# Altium project WRO.PrjPcb
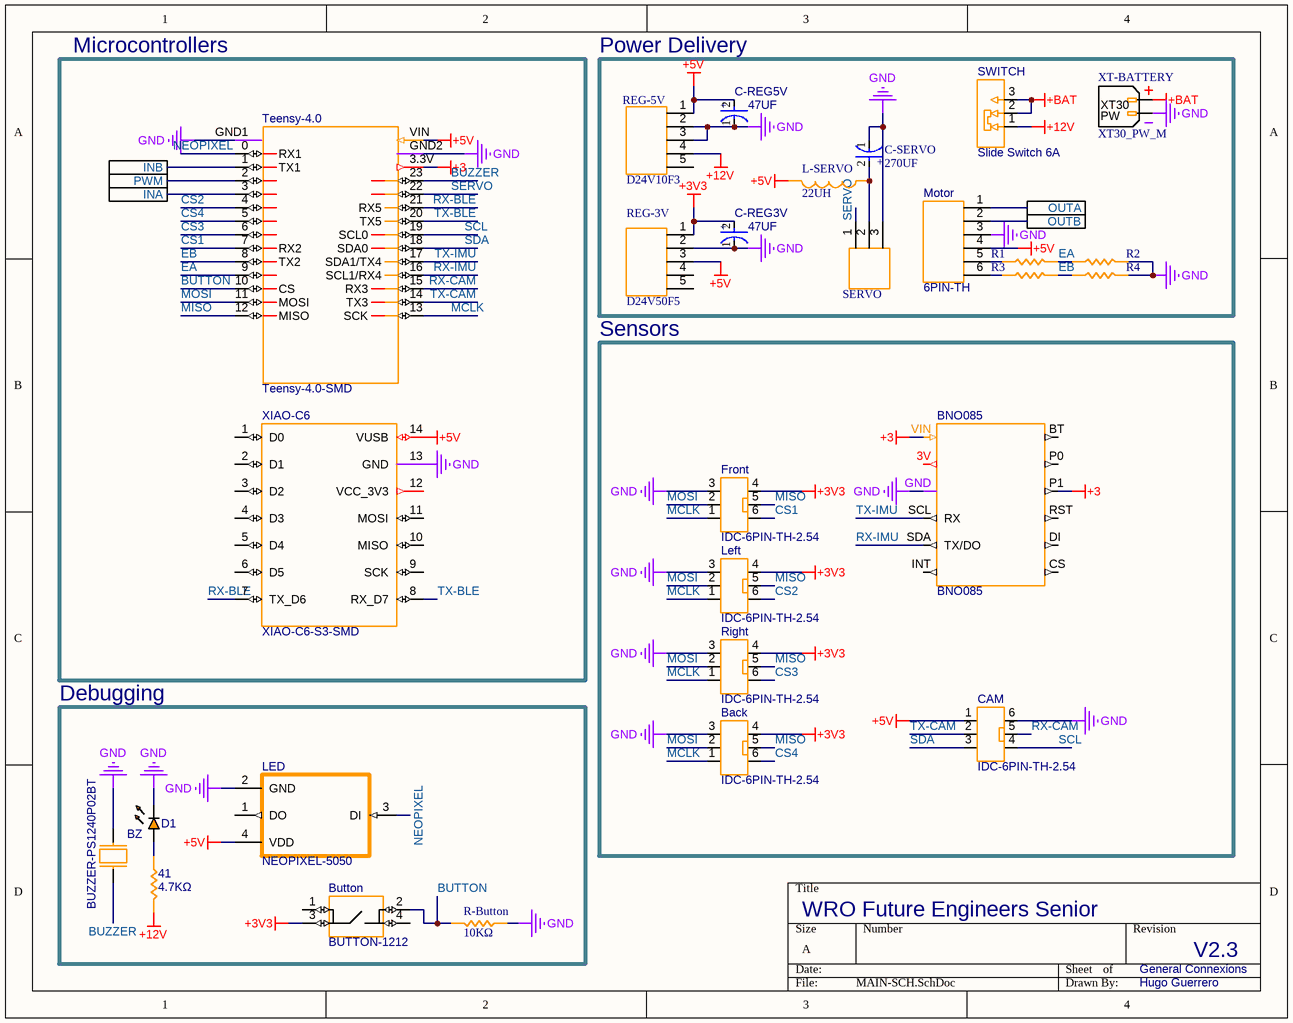
[diagram p0: MAIN-SCH.SchDoc]
2 sheets, 44 parts. Net scope: flat (ports and power ports of the same name join across sheets).
Board file: MAIN-PCB.PcbDoc
Sheets:
  MAIN-SCH.SchDoc
  H-BRIDGE-SCH.SchDoc

## Sheet MAIN-SCH.SchDoc
size A; SheetNumber: 1; SheetTotal: 2

### Parts
41  4.7KΩ  [RES_0603]
Back  IDC-6PIN-TH-2.54  [IDC-6PIN-TH-2.54]
BNO085  BNO085  [BNO085]
Button  BUTTON-1212  [BUTTON]
BZ  BUZZER-PS1240P02BT  [BUZZER]
C-REG3V  47UF  [FP-FTD8-MFG]
C-REG5V  47UF  [FP-FTD8-MFG]
C-SERVO  270UF  [FP-FTD8-MFG]
CAM  IDC-6PIN-TH-2.54  [IDC-6PIN-TH-2.54]
D1  LED_0603  [LED_0603]  (value not drawn)
D24V10F3  REG-5V  [5PIN-TH]
D24V50F5  REG-3V  [5PIN-TH]
Front  IDC-6PIN-TH-2.54  [IDC-6PIN-TH-2.54]
L-SERVO  22UH  [WRO-INDUCTOR]
LED  NEOPIXEL-5050  [NEOPIXEL-5050]
Left  IDC-6PIN-TH-2.54  [IDC-6PIN-TH-2.54]
Motor  6PIN-TH  [6PIN-TH]
R1  10KΩ  [RES_0603]  (value not drawn)
R2  10KΩ  [RES_0603]  (value not drawn)
R3  10KΩ  [RES_0603]  (value not drawn)
R4  10KΩ  [RES_0603]  (value not drawn)
R-Button  10KΩ  [RES_0603]
Right  IDC-6PIN-TH-2.54  [IDC-6PIN-TH-2.54]
SERVO  3PIN  [3PIN]  (value not drawn)
SWITCH  Slide Switch 6A  [Slide Switch 6A]
Teensy-4.0  Teensy-4.0-SMD  [Teensy-4.0-SMD]
XIAO-C6  XIAO-C6-S3-SMD  [XIAO-C6-S3-SMD]
XT-BATTERY  XT30_PW_M  [XT30_PW_M]

### Blocks framed on the sheet
Microcontrollers: Teensy-4.0 XIAO-C6
Power Delivery: C-REG3V C-REG5V C-SERVO D24V10F3 D24V50F5 L-SERVO Motor R1-R4 SERVO SWITCH XT-BATTERY
Sensors: Back BNO085 CAM Front Left Right
Debugging: 41 Button BZ D1 LED R-Button

### Ports
INA (see VNH7070-P[1C]), INB (see VNH7070-P[1C]), OUTA (see VNH7070-P[3C]), OUTB (see VNH7070-P[3C]), PWM (see VNH7070-P[1C])

### Nets
+3: BNO085.P1 BNO085.VIN Teensy-4.0.3.3V(3.3V-2)
+3V3: Back.4 Button.3 C-REG3V.2(A) D24V50F5.1 Front.4 Left.4 Right.4
+5V: C-REG5V.2(A) CAM.1 D24V10F3.1 D24V50F5.3 L-SERVO.2 LED.4(VDD) Motor.4 Teensy-4.0.VIN XIAO-C6.14(VUSB)
+12V: 41.1 D24V10F3.4 SWITCH.1(NC)
+BAT: SWITCH.2(COM) SWITCH.3(NO) XT-BATTERY.P
GND: Back.3 BNO085.GND BZ.2 C-REG3V.1(C) C-REG5V.1(C) C-SERVO.1(C) CAM.6 D1.C D24V10F3.2 D24V10F3.3 D24V50F5.2 Front.3 LED.2(GND) Left.3 Motor.3 R2.1 R4.1 R-Button.2 Right.3 SERVO.3 Teensy-4.0.GND1 Teensy-4.0.GND2(GND3) XIAO-C6.13(GND) XT-BATTERY.N
BUTTON: Button.2 R-Button.1 Teensy-4.0.10(CS)
BUZZER: BZ.1 Teensy-4.0.23
CS1: Front.6 Teensy-4.0.7(RX2)
CS2: Left.6 Teensy-4.0.4
CS3: Right.6 Teensy-4.0.6
CS4: Back.6 Teensy-4.0.5
EA: R1.1 R2.2 Teensy-4.0.9
EB: R3.1 R4.2 Teensy-4.0.8(TX2)
MCLK: Back.1 Front.1 Left.1 Right.1 Teensy-4.0.13(SCK)
MISO: Back.5 Front.5 Left.5 Right.5 Teensy-4.0.12(MISO)
MOSI: Back.2 Front.2 Left.2 Right.2 Teensy-4.0.11(MOSI)
NEOPIXEL: LED.3(DI) Teensy-4.0.0(RX1)
OUTA: Motor.1 ; port OUTA
OUTB: Motor.2 ; port OUTB
RX-BLE: Teensy-4.0.21(RX5) XIAO-C6.7(TX_D6)
RX-CAM: CAM.5 Teensy-4.0.15(RX3)
RX-IMU: BNO085.SDA(TX/DO) Teensy-4.0.16(SCL1/RX4)
SCL: CAM.4 Teensy-4.0.19(SCL0)
SDA: CAM.3 Teensy-4.0.18(SDA0)
SERVO: SERVO.1 Teensy-4.0.22
TX-BLE: Teensy-4.0.20(TX5) XIAO-C6.8(RX_D7)
TX-CAM: CAM.2 Teensy-4.0.14(TX3)
TX-IMU: BNO085.SCL(RX) Teensy-4.0.17(SDA1/TX4)
Net41_2: 41.2 D1.A
NetC-SERVO_2: C-SERVO.2(A) L-SERVO.1 SERVO.2
NetMotor_5: Motor.5 R1.2
NetMotor_6: Motor.6 R3.2
NetR41_1: Teensy-4.0.3 ; port INA
NetR42_1: Teensy-4.0.1(TX1) ; port INB
NetR43_1: Teensy-4.0.2 ; port PWM

Not connected (* = marked no-connect by the designer): BNO085 3V BT CS DI INT P0 RST; Button 1 4; D24V10F3 5(05); D24V50F5 4(04) 5(05); LED 1(DO); XIAO-C6 1(D0) 2(D1) 3(D2) 4(D3) 5(D4) 6(D5) 9(SCK) 10(MISO) 11(MOSI) 12(VCC_3V3)

### Notes on the sheet
- WRO Future Engineers Senior
- General Connexions
- V2.3
- Hugo Guerrero
- (in symbol CMP-05427-000088-1) +
- (in symbol XT30_PW_M) XT30; PW

### Library data of the parts
41 R1-R4 R-Button = RES_0603: Resistor SMD 0603 generic
Button = BUTTON
C-REG3V C-REG5V C-SERVO = CMP-05427-000088-1: CAP ALUM 220UF 20% 25V SMD; Dielectric Material: Aluminium; ESR (Equivalent Series Resistance): 160mR; Ripple Current: 600mA; Life (Hours): 2000Hour; Leakage Current: 55uA; Lead Diameter: 0.65mm; Series: FT; RoHS Compliant: Yes; Case/Package: Radial; Packaging: Tape and Reel; Contact Plating: Tin; Package Quantity: 1; Mount: Surface Mount; Number of Pins: 8; Tolerance: 20%; Height - Seated (Max): 0.315inch; Length: 7.7mm; Lead Free: Lead Free; Voltage: 25V; Construction: Cylindrical; Radiation Hardening: No; Lead Pitch: 1.8mm; REACH SVHC: No SVHC; Capacitance: 220uF; Voltage Rating: 25V; Height: 7.7mm; Diameter: 6.3mm; Max Operating Temperature: 105°C; Termination: SMD/SMT; Min Operating Temperature: -55°C; Voltage Rating (DC): 25V; Ripple Current (AC): 600mA
D24V10F3 D24V50F5 = 5PIN-TH: 2.54 Header
L-SERVO = WRO-INDUCTOR: Voltage Boost Inductor
SERVO = 3PIN: 2.54 Header

## Sheet H-BRIDGE-SCH.SchDoc
size A; SheetNumber: 2; SheetTotal: 2
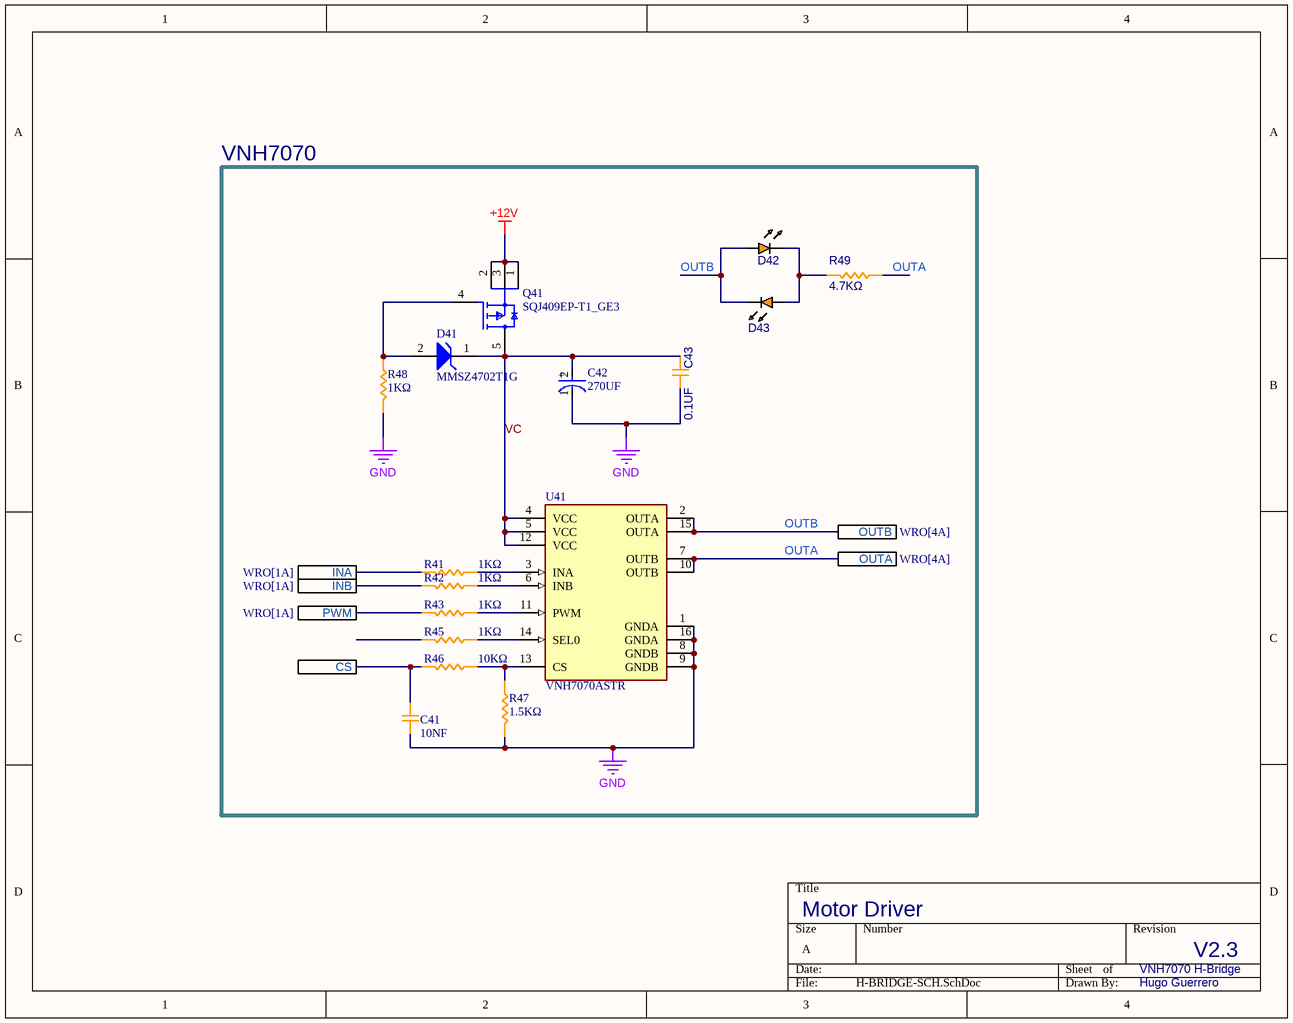
[diagram p1: H-BRIDGE-SCH.SchDoc]

### Parts
C41  10NF  [CAP_0603]
C42  270UF  [FP-FTD8-MFG]
C43  0.1UF  [CAP_0603]
D41  MMSZ4702T1G  [ONSC-SOD-123-2-425-04_V]
D42  LED_0603  [LED_0603]  (value not drawn)
D43  LED_0603  [LED_0603]  (value not drawn)
Q41  SQJ409EP-T1_GE3  [FP-T16-0221-SINGLE-MFG]
R41  1KΩ  [RES_0603]
R42  1KΩ  [RES_0603]
R43  1KΩ  [RES_0603]
R45  1KΩ  [RES_0603]
R46  10KΩ  [RES_0603]
R47  1.5KΩ  [RES_0603]
R48  1KΩ  [RES_0603]
R49  4.7KΩ  [RES_0603]
U41  VNH7070ASTR  [FP-SO-16N-GAPGCFT00818-MFG]

### Blocks framed on the sheet
VNH7070: C41-C43 D41-D43 Q41 R41-R43 R45-R49 U41

### Ports
CS, INA (see WRO[1A]), INB (see WRO[1A]), OUTA (see WRO[4A]), OUTB (see WRO[4A]), PWM (see WRO[1A])

### Nets
+12V: Q41.1(S) Q41.2(S) Q41.3(S)
GND: C41.1 C42.1(C) C43.2 R47.1 R48.1 U41.1(GNDA) U41.8(GNDB) U41.9(GNDB) U41.16(GNDA)
OUTA: R49.2 U41.7(OUTB) U41.10(OUTB) ; port OUTA
OUTB: D42.A D43.C U41.2(OUTA) U41.15(OUTA) ; port OUTB
VC: C42.2(A) C43.1 D41.1(K) Q41.5(D) U41.4(VCC) U41.5(VCC) U41.12(VCC)
NetC41_2: C41.2 R46.1 ; port CS
NetD41_2: D41.2(A) Q41.4(G) R48.2
NetD42_C: D42.C D43.A R49.1
NetR41_1: R41.1 ; port INA
NetR41_2: R41.2 U41.3(INA)
NetR42_1: R42.1 ; port INB
NetR42_2: R42.2 U41.6(INB)
NetR43_1: R43.1 ; port PWM
NetR43_2: R43.2 U41.11(PWM)
NetR45_2: R45.2 U41.14(SEL0)
NetR46_2: R46.2 R47.2 U41.13(CS)

Not connected (* = marked no-connect by the designer): R45 1

### Notes on the sheet
- Motor Driver
- VNH7070 H-Bridge
- V2.3
- Hugo Guerrero
- (in symbol CMP-05427-000088-1) +

### Library data of the parts
C41 C43 = CAP_0603: Capacitor SMD 0603 generic
C42 = CMP-05427-000088-1: as C-REG3V on sheet MAIN-SCH; Series: FT; RoHS Compliant: Yes; Case/Package: Radial; Packaging: Tape and Reel; Contact Plating: Tin; Package Quantity: 1; Mount: Surface Mount; Number of Pins: 8; Tolerance: 20%; Height - Seated (Max): 0.315inch; Length: 7.7mm; Lead Free: Lead Free; Voltage: 25V; Construction: Cylindrical; Radiation Hardening: No; Lead Pitch: 1.8mm; REACH SVHC: No SVHC; Capacitance: 220uF; Voltage Rating: 25V; Height: 7.7mm; Diameter: 6.3mm; Max Operating Temperature: 105°C; Termination: SMD/SMT; Min Operating Temperature: -55°C; Voltage Rating (DC): 25V; Ripple Current (AC): 600mA
D41 = CMP-1060-00296-1: Zener Voltage Regulator, 500 mW, 2-Pin SOD-123, Pb-Free, Tape and Reel; Manufacturer: On Semiconductor; VZ Typ (V): 15; P Max (W): 0.5; PackageVersion: Rev. G, 10/2009; ComponentLink3URL: http://www.onsemi.com/pub_link/Collateral/425-04.PDF; PackageReference: SOD-123-2-425-04; ComponentLink2URL: http://www.onsemi.com/pub_link/Collateral/MMSZ4678T1-D.PDF; PartNumber: MMSZ4702T1G; ComponentLink3Description: Package Specification; PackageDescription: 2-Pin SOD, Body 1.6 x 2.69 mm; ComponentLink1Description: Manufacturer URL; ComponentLink1URL: http://www.onsemi.com/; ComponentLink2Description: Datasheet; DatasheetVersion: Rev. 9; Packing: Tape and Reel; Mounting Technology: Surface Mount; RoHS: Pb-Free
Q41 = CMP-02550-000144-1: MOSFET P-CH 40V 60A POWERPAKSO-8; Manufacturer: Vishay; Number Of P Channels: 1; Reverse Recovery Time: 39ns; Standoff Height: 0mm; Automotive Grade: Grade 0; Continuous Drain Current: -60A; Gate Charge At Vgs: 170nC @ -10V; Power Dissipation: 68W; Input Capacitace At Vds: 8400pF @ -25V; Drain To Source Resistance: 0.0058Ω; Depletion Mode: False; Rthja Max: 68°C/W; Gate To Source Voltage: 20V; Drain To Source Voltage: -40V; Threshold Vgs Max: -2.5V; Turn Off Delay Time: 75ns; Threshold Vgs Min: -1.5V; Reverse Recovery Charge: 45nC; Turn On Delay Time: 23ns; Typ Forward Diode Voltage: -0.76V; Transconductance: 54S; Max Junction Temp: +175°C; Max Forward Diode Voltage: -1.2V; Pulse Drain Current: -150A; Digikey Description: MOSFET P-CH 40V 60A POWERPAKSO-8; Device Class L2: Transistors; Height: 1.267mm; Octopart: https://octopart.com/sqj409ep-t1_ge3-vishay-82218774; Device Class L3: MOSFETs; ComponentLink2URL: https://www.vishay.com/docs/77707/sqj409ep.pdf; ComponentLink2Description: Datasheet; Footprint Url: http://www.vishay.com/docs/63818/ppso8ls.pdf; Device Class L1: Discrete Semiconductors; Temperature: -55°C to +175°C; Package: T16-0221-SINGLE; Drain To Source Breakdown Voltage: -40V; Automotive: Yes; Manufacturer Part Number: SQJ409EP-T1_GE3; Temperature Range High: +175°C; Mouser Description: Trans MOSFET P-CH 40V 60A Automotive 5-Pin(4+Tab) PowerPAK SO T/R; RoHS: TRUE; Temperature Range Low: -55°C; Category: Trans; Lead Free: Yes; Number Of Channels: 1
R41-R43 R45-R49 = RES_0603: Resistor SMD 0603 generic
U41 = CMP-2000-07519-2: IC MOTOR DRIVER 4V-28V 16SOIC; Manufacturer: STMicroelectronics; Standoff Height: 0.1mm; Number Of Outputs: 2; Max Junction Temp: +150°C; Output Current: 15A; Max Supply Voltage: 28V; Automotive Grade: Grade 0; Motor Type: Brushed; Min Supply Voltage: 4V; Nominal Supply Current: 2-3.5mA; Digikey Description: IC MOTOR DRIVER 4V-28V 16SOIC; Device Class L1: Integrated Circuits (ICs); Ipc Land Pattern Name: SOIC127P600X175-16; Device Class L2: Power Management ICs; ComponentLink2Description: Datasheet; ComponentLink2URL: https://www.st.com/resource/en/datasheet/vnh7070as.pdf; Height: 1.75mm; RoHS: TRUE; Manufacturer Part Number: VNH7070ASTR; Octopart: https://octopart.com/vnh7070astr-stmicroelectronics-66668687; Temperature Range Low: -40°C; Mouser Description: STMicroelectronics VNH7070ASTR Motor Driver IC 16-Pin, SOIC; Device Class L3: Motor Drivers; Lead Free: Yes; Temperature: -40°C to +150°C; Automotive: Yes; Package: SO-16N-GAPGCFT00818; Temperature Range High: +150°C; Category: IC; Footprint Url: https://www.st.com/resource/en/datasheet/l6566a.pdf

## Nets that join several sheets
+12V: MAIN-SCH (41.1 D24V10F3.4 SWITCH.1), H-BRIDGE-SCH (Q41.1 Q41.2 Q41.3)
GND: MAIN-SCH (24 pins), H-BRIDGE-SCH (9 pins)
NetR41_1: MAIN-SCH (Teensy-4.0.3), H-BRIDGE-SCH (R41.1)
NetR42_1: MAIN-SCH (Teensy-4.0.1), H-BRIDGE-SCH (R42.1)
NetR43_1: MAIN-SCH (Teensy-4.0.2), H-BRIDGE-SCH (R43.1)
OUTA: MAIN-SCH (Motor.1), H-BRIDGE-SCH (R49.2 U41.7 U41.10)
OUTB: MAIN-SCH (Motor.2), H-BRIDGE-SCH (D42.A D43.C U41.2 U41.15)